# Altium project senocore.PrjPcb
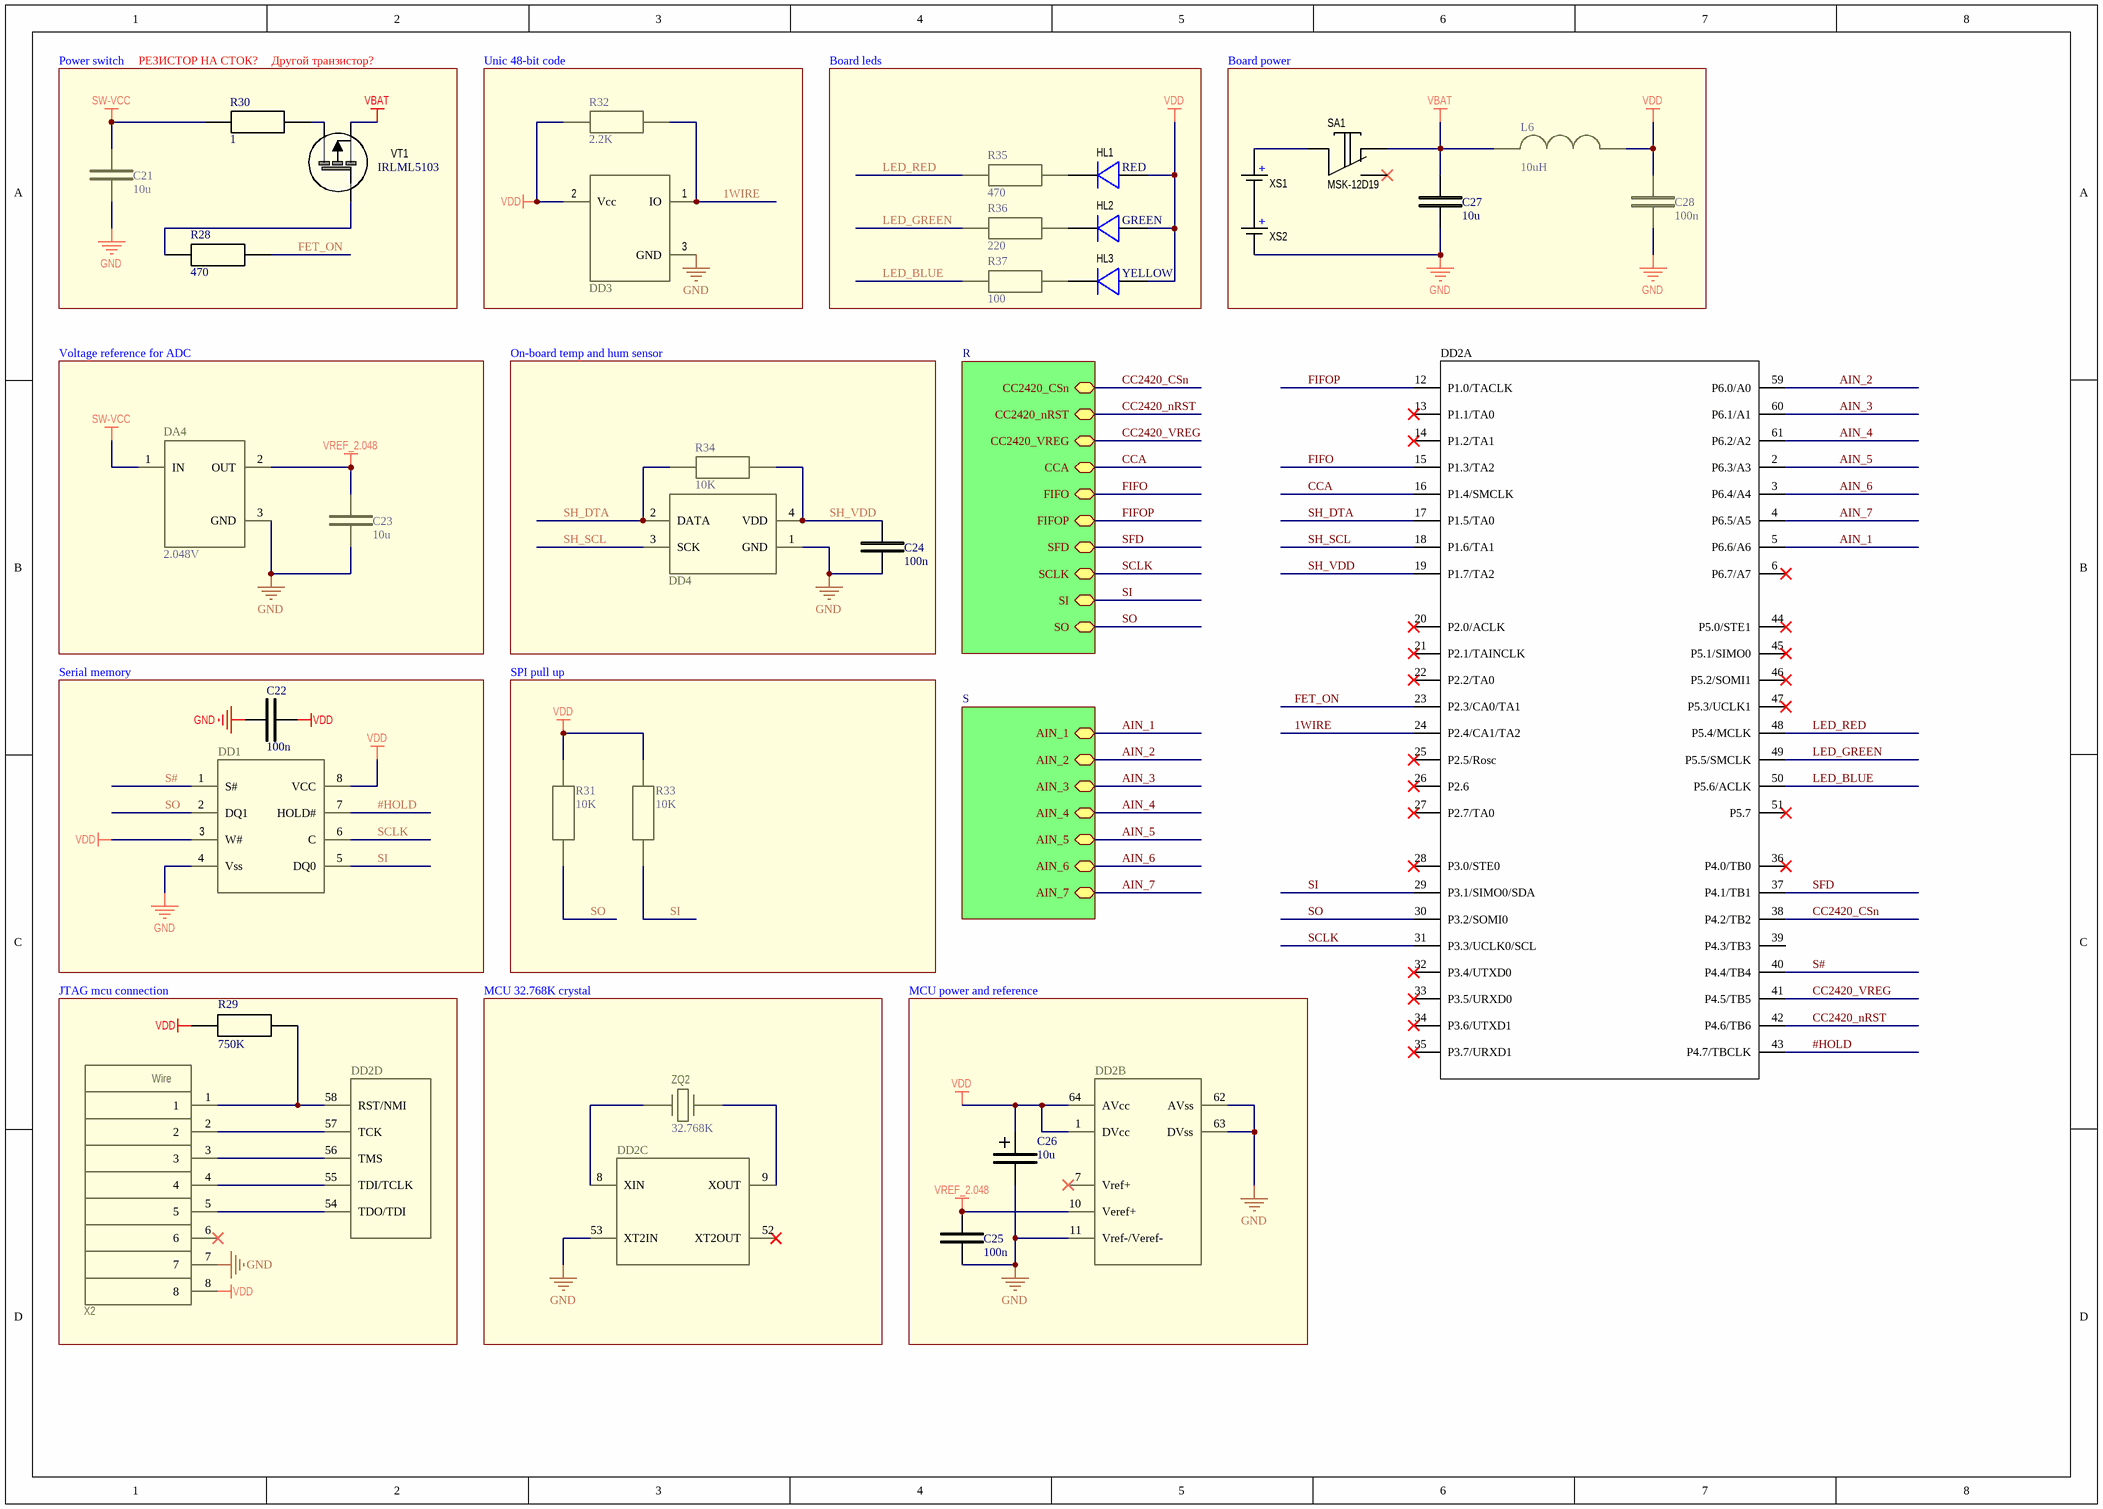
[diagram p0: senocore.SchDoc]
3 sheets, 91 parts. Net scope: hierarchical (ports join the sheet entries above them; power ports are global).
Board file: senocore_pcb_long.PcbDoc
Sheets:
  senocore.SchDoc
    R = radio.SchDoc
    S = NTC connector.SchDoc

## Sheet senocore.SchDoc
size A3

### Parts
C21  10u  [CAP0805]
C22  100n  [CAP0402]
C23  10u  [CAP0805]
C24  100n  [CAP0402]
C25  100n  [CAP0402]
C26  10u  [CapSMDA]
C27  10u  [CAP0805]
C28  100n  [CAP0402]
DA4  2.048V  [SC70-3]
DD1  M25P80V6  [So-8W]  (value not drawn)
DD2  M430F1611  [LQFP-64]  (value not drawn)  (parts A,B,C,D of 4)
DD3  DS2411  [SOT-23-3]  (value not drawn)
DD4  SHT10  [SHT1x]  (value not drawn)
HL1  RED  [LED RED TH L-1394IDT]
HL2  GREEN  [LED GREEN TH L-1394GDT]
HL3  YELLOW  [LED YELLOW TH L-1394YDT]
L6  10uH  [IND0805]
R28  470  [RES0402]
R29  750K  [RES0402]
R30  1  [RES0402]
R31  10K  [RES0402]
R32  2.2K  [RES0402]
R33  10K  [RES0402]
R34  10K  [RES0402]
R35  470  [RES0402]
R36  220  [RES0402]
R37  100  [RES0402]
SA1  MSK-12D19  [MSK-12D19 SPDT]
VT1  IRLML5103  [SOT-23-3]
X2  DS-1026-06 2X4  [PBD2-8 2mm]  (value not drawn)
XS1  Keystone AA Battery Clip  [KEYSTONE AA CLIPS]  (value not drawn)
XS2  Keystone AA Battery Clip  [KEYSTONE AA CLIPS]  (value not drawn)
ZQ2  32.768K  [DT-26]

### Blocks framed on the sheet
Unic 48-bit code: DD3 R32
Board leds: HL1-HL3 R35-R37
Board power: C27 C28 L6 SA1 XS1 XS2
Voltage reference for ADC: C23 DA4
On-board temp and hum sensor: C24 DD4 R34
Serial memory: C22 DD1
SPI pull up: R31 R33
JTAG mcu connection: DD2 R29 X2
MCU 32.768K crystal: DD2 ZQ2
MCU power and reference: C25 C26 DD2

### Sub-sheets
R = radio.SchDoc: CC2420_CSn, CC2420_nRST, CC2420_VREG, CCA, FIFO, FIFOP, SCLK, SFD, SI, SO
S = NTC connector.SchDoc: AIN_1, AIN_2, AIN_3, AIN_4, AIN_5, AIN_6, AIN_7

### Nets
GND: C21.2 C22.1 C23.2 C24.2 C25.2 C26.2 C27.2 C28.2 DA4.3(GND) DD1.4(Vss) DD2.11(Vref-/Veref-) DD2.53(XT2IN) DD2.62(AVss) DD2.63(DVss) DD3.3(GND) DD4.1(GND) X2.7 XS2.2
SW-VCC: C21.1 DA4.1(IN) R30.2
VBAT: C27.1 L6.1 SA1.1 VT1.2
VDD: C22.2 C26.1 C28.1 DD1.3(W#) DD1.8(VCC) DD2.1(DVcc) DD2.64(AVcc) DD3.2(Vcc) HL1.1(Anode) HL2.1(Anode) HL3.1(Anode) L6.2 R29.2 R31.1 R32.2 R33.1 X2.8
VREF_2.048: C23.1 C25.1 DA4.2(OUT) DD2.10(Veref+)
1WIRE: DD2.24(P2.4/CA1/TA2) DD3.1(IO) R32.1
#HOLD: DD1.7(HOLD#) DD2.43(P4.7/TBCLK)
AIN_1: DD2.5(P6.6/A6) ; sheet S/AIN_1
AIN_2: DD2.59(P6.0/A0) ; sheet S/AIN_2
AIN_3: DD2.60(P6.1/A1) ; sheet S/AIN_3
AIN_4: DD2.61(P6.2/A2) ; sheet S/AIN_4
AIN_5: DD2.2(P6.3/A3) ; sheet S/AIN_5
AIN_6: DD2.3(P6.4/A4) ; sheet S/AIN_6
AIN_7: DD2.4(P6.5/A5) ; sheet S/AIN_7
CC2420_CSn: DD2.38(P4.2/TB2) ; sheet R/CC2420_CSn
CC2420_nRST: DD2.42(P4.6/TB6) ; sheet R/CC2420_nRST
CC2420_VREG: DD2.41(P4.5/TB5) ; sheet R/CC2420_VREG
CCA: DD2.16(P1.4/SMCLK) ; sheet R/CCA
FET_ON: DD2.23(P2.3/CA0/TA1) R28.1
FIFO: DD2.15(P1.3/TA2) ; sheet R/FIFO
FIFOP: DD2.12(P1.0/TACLK) ; sheet R/FIFOP
LED_BLUE: DD2.50(P5.6/ACLK) R37.2
LED_GREEN: DD2.49(P5.5/SMCLK) R36.2
LED_RED: DD2.48(P5.4/MCLK) R35.2
S#: DD1.1(S#) DD2.40(P4.4/TB4)
SCLK: DD1.6(C) DD2.31(P3.3/UCLK0/SCL) ; sheet R/SCLK
SFD: DD2.37(P4.1/TB1) ; sheet R/SFD
SH_DTA: DD2.17(P1.5/TA0) DD4.2(DATA) R34.2
SH_SCL: DD2.18(P1.6/TA1) DD4.3(SCK)
SH_VDD: C24.1 DD2.19(P1.7/TA2) DD4.4(VDD) R34.1
SI: DD1.5(DQ0) DD2.29(P3.1/SIMO0/SDA) R33.2 ; sheet R/SI
SO: DD1.2(DQ1) DD2.30(P3.2/SOMI0) R31.2 ; sheet R/SO
NetDD2_8: DD2.8(XIN) ZQ2.1
NetDD2_9: DD2.9(XOUT) ZQ2.2
NetDD2_54: DD2.54(TDO/TDI) X2.5
NetDD2_55: DD2.55(TDI/TCLK) X2.4
NetDD2_56: DD2.56(TMS) X2.3
NetDD2_57: DD2.57(TCK) X2.2
NetDD2_58: DD2.58(RST/NMI) R29.1 X2.1
NetHL1_2: HL1.2(Cathode) R35.1
NetHL2_2: HL2.2(Cathode) R36.1
NetHL3_2: HL3.2(Cathode) R37.1
NetR28_2: R28.2 VT1.1
NetR30_1: R30.1 VT1.3
NetSA1_2: SA1.2 XS1.1(+)
NetXS1_2: XS1.2 XS2.1(+)

Not connected (* = marked no-connect by the designer): DD2 6(P6.7/A7)* 7(Vref+)* 13(P1.1/TA0)* 14(P1.2/TA1)* 20(P2.0/ACLK)* 21(P2.1/TAINCLK)* 22(P2.2/TA0)* 25(P2.5/Rosc)* 26(P2.6)* 27(P2.7/TA0)* 28(P3.0/STE0)* 32(P3.4/UTXD0)* 33(P3.5/URXD0)* 34(P3.6/UTXD1)* 35(P3.7/URXD1)* 36(P4.0/TB0)* 39(P4.3/TB3) 44(P5.0/STE1)* 45(P5.1/SIMO0)* 46(P5.2/SOMI1)* 47(P5.3/UCLK1)* 51(P5.7)* 52(XT2OUT)*; SA1 3*; X2 6*

### Notes on the sheet
- Power switch
- (near R30) РЕЗИСТОР НА СТОК?
- (near R30) Другой транзистор?
- (in symbol PBD2-8 step 2mm) Wire

### Library data of the parts
C21 C23 C27 = 10u SMD 0805: 0805 SMD; PartNumber: CL21A106KPFNNNG; Manufacturer: Samsung; Supplier: Terraelectronica; Unit Price: 1.2; WebLink: https://www.terraelectronica.ru/product/984943
C22 C24 C25 C28 = 100n SMD 0402: 0402 SMD; PartNumber: CC0402ZRY5V7BB104; Manufacturer: Yageo; Supplier: Terraelectronica; Unit Price: 0.22; WebLink: https://www.terraelectronica.ru/product/543093
C26 = 10u SMD TYPE A: SMD TYPE A; PartNumber: T491A106K010AT; Manufacturer: Kemet; Supplier: Terraelectronica; Unit Price: 5; WebLink: https://www.terraelectronica.ru/product/556976
DA4 = REF3320: Reference 2.048V; PartNumber: REF3318AIDCKR, REF3318AIDCKT; Manufacturer: Texas Instruments; Supplier: Terrraelectronica; Unit Price: 67; WebLink: https://www.terraelectronica.ru/catalog/istochniki-opornogo-napryazheniya-i-toka-256?text=ref3320&search=ref3320
DD1 = M25P80V6: Serial memory 2.7-3.6V, 8 Mbit (1 Mbyte); PartNumber: M25P80-VMW; Manufacturer: Micron; Supplier: Chipdip; Unit Price: 130; WebLink: https://www.chipdip.ru/product1/8344124196
DD2 = M430F1611: MCU; PartNumber: MSP430F1611IPM; Manufacturer: Texas Instruments; Supplier: Terraelectronica; Unit Price: 1480; WebLink: https://www.terraelectronica.ru/product/67958
DD3 = DS2411: Unic 48bit serial code. Family code 0x01; PartNumber: DS2411R+T&R; Manufacturer: Maxim; Supplier: Chipdip; Unit Price: 130; WebLink: https://www.chipdip.ru/product/ds2411r-t-r-2
DD4 = SHT10: Temp and hum sensor; Manufacturer: Sensirion; PartNumber: SHT10; Supplier: Terraelectronica; Unit Price: 998; WebLink: https://www.terraelectronica.ru/product/325109
HL1 = LED Flat top RED TH 3.4mm/2mm: 10 mA, V=2.5 V; PartNumber: GNL-3012HD; Manufacturer: G-nor Electronics; Supplier: Chipdip; Unit Price: 8; WebLink: https://www.chipdip.ru/product/gnl-3012hd
HL2 = LED Flat top GREEN TH 3.4mm/2mm: 10 mA, V=2.5 V; PartNumber: GNL-3012GD; Manufacturer: G-nor Electronics; Supplier: Chipdip; Unit Price: 8; WebLink: https://www.chipdip.ru/product/gnl-3012gd
HL3 = LED Flat top YELLOW TH 3.4mm/2mm: 10 mA, V=2.5 V; PartNumber: GNL-3012YD; Manufacturer: G-nor Electronics; Supplier: Chipdip; Unit Price: 8; WebLink: https://www.chipdip.ru/product/gnl-3012yd
L6 = IND 10uH SMD 0805: 0805 SMD; PartNumber: LQM21FN100M80L; Manufacturer: Murata; Supplier: Terraelectronica; Unit Price: 4.4; WebLink: https://www.terraelectronica.ru/product/1496283
R28 R35 = 470R 1% SMD 0402: 1% 0402 SMD 0.063W; PartNumber: RC0402FR-07470RL; Manufacturer: Yageo; Supplier: Terraelectronica; Unit Price: 0.1; WebLink: https://www.terraelectronica.ru/product/870778
R29 = 750K 1% SMD 0402: 1% 0402 SMD 0.063W; PartNumber: RC0402FR-07750KL; Manufacturer: Yageo; Supplier: Terraelectronica; Unit Price: 0.1; WebLink: https://www.terraelectronica.ru/product/870851
R30 = 1R 1% SMD 0402: 1% 0402 SMD 0.063W; PartNumber: RC0402FR-071RL; Manufacturer: Yageo; Supplier: Terraelectronica; Unit Price: 0.1; WebLink: https://www.terraelectronica.ru/product/870639
R31 R33 R34 = 10K 1% SMD 0402: 1% 0402 SMD 0.063W; PartNumber: RC0402FR-0710KL; Manufacturer: Yageo; Supplier: Terraelectronica; Unit Price: 0.1; WebLink: tps://www.terraelectronica.ru/product/358779
R32 = 2.2K 1% SMD 0402: 1% 0402 SMD 0.063W; PartNumber: RC0402FR-072K2L; Manufacturer: Yageo; Supplier: Terraelectronica; Unit Price: 0.11; WebLink: https://www.terraelectronica.ru/product/560314
R36 = 220R 1% SMD 0402: 1% 0402 SMD 0.063W; PartNumber: RC0402FR-07220RL; Manufacturer: Yageo; Supplier: Terraelectronica; Unit Price: 0.1; WebLink: https://www.terraelectronica.ru/product/870650
R37 = 100R 1% SMD 0402: 1% 0402 SMD 0.063W; PartNumber: RC0402FR-07100RL; Manufacturer: Yageo; Supplier: Terraelectronica; Unit Price: 0.11; WebLink: https://www.terraelectronica.ru/product/361823
SA1 = SPD 3 pin MSK-12D19: Slide switch 3 pin; Manufacturer: Shenzhen Intech Electronic; WebLink: http://www.intechswitch.com/products/SideKnobToggleslideswitchseries/641.html; Unit Price: 20; PartNumber: MSK-12D19
VT1 = IRLML5103: p-mosfet   -30V 0.76A Vgs=-1V; PartNumber: IRLML5103TRPBF; Manufacturer: International Rectifier; Supplier: Chipdip; Unit Price: 9; WebLink: https://www.chipdip.ru/product/irlml5103tr
X2 = PBD2-8 step 2mm: Step 2mm 2x4 height 4.3mm; PartNumber: DS1026-06-2*4S8BV; Manufacturer: Ningbo connfly electronic; Supplier: Chipdip; Unit Price: 11; WebLink: https://www.chipdip.ru/product/pbd2-8
XS1 XS2 = Keystone AA Battery Clip: Button Contact; PartNumber: 92; WebLink: https://www.keyelco.com/category.cfm/Cylindrical-Cell-Clips-THM-and-SMT/AA-CR2-Battery-Clips-and-Contacts/id/945; Manufacturer: Keystone
ZQ2 = ZQ 32.768K 12.5pF 20ppm: Load 12.5pF 20ppm; PartNumber: 32768Hz(2x6mm); Manufacturer: China; Supplier: Chipdip; Unit Price: 12; WebLink: https://www.chipdip.ru/product/32768hz-2x6mm

## Sheet radio.SchDoc
size A3
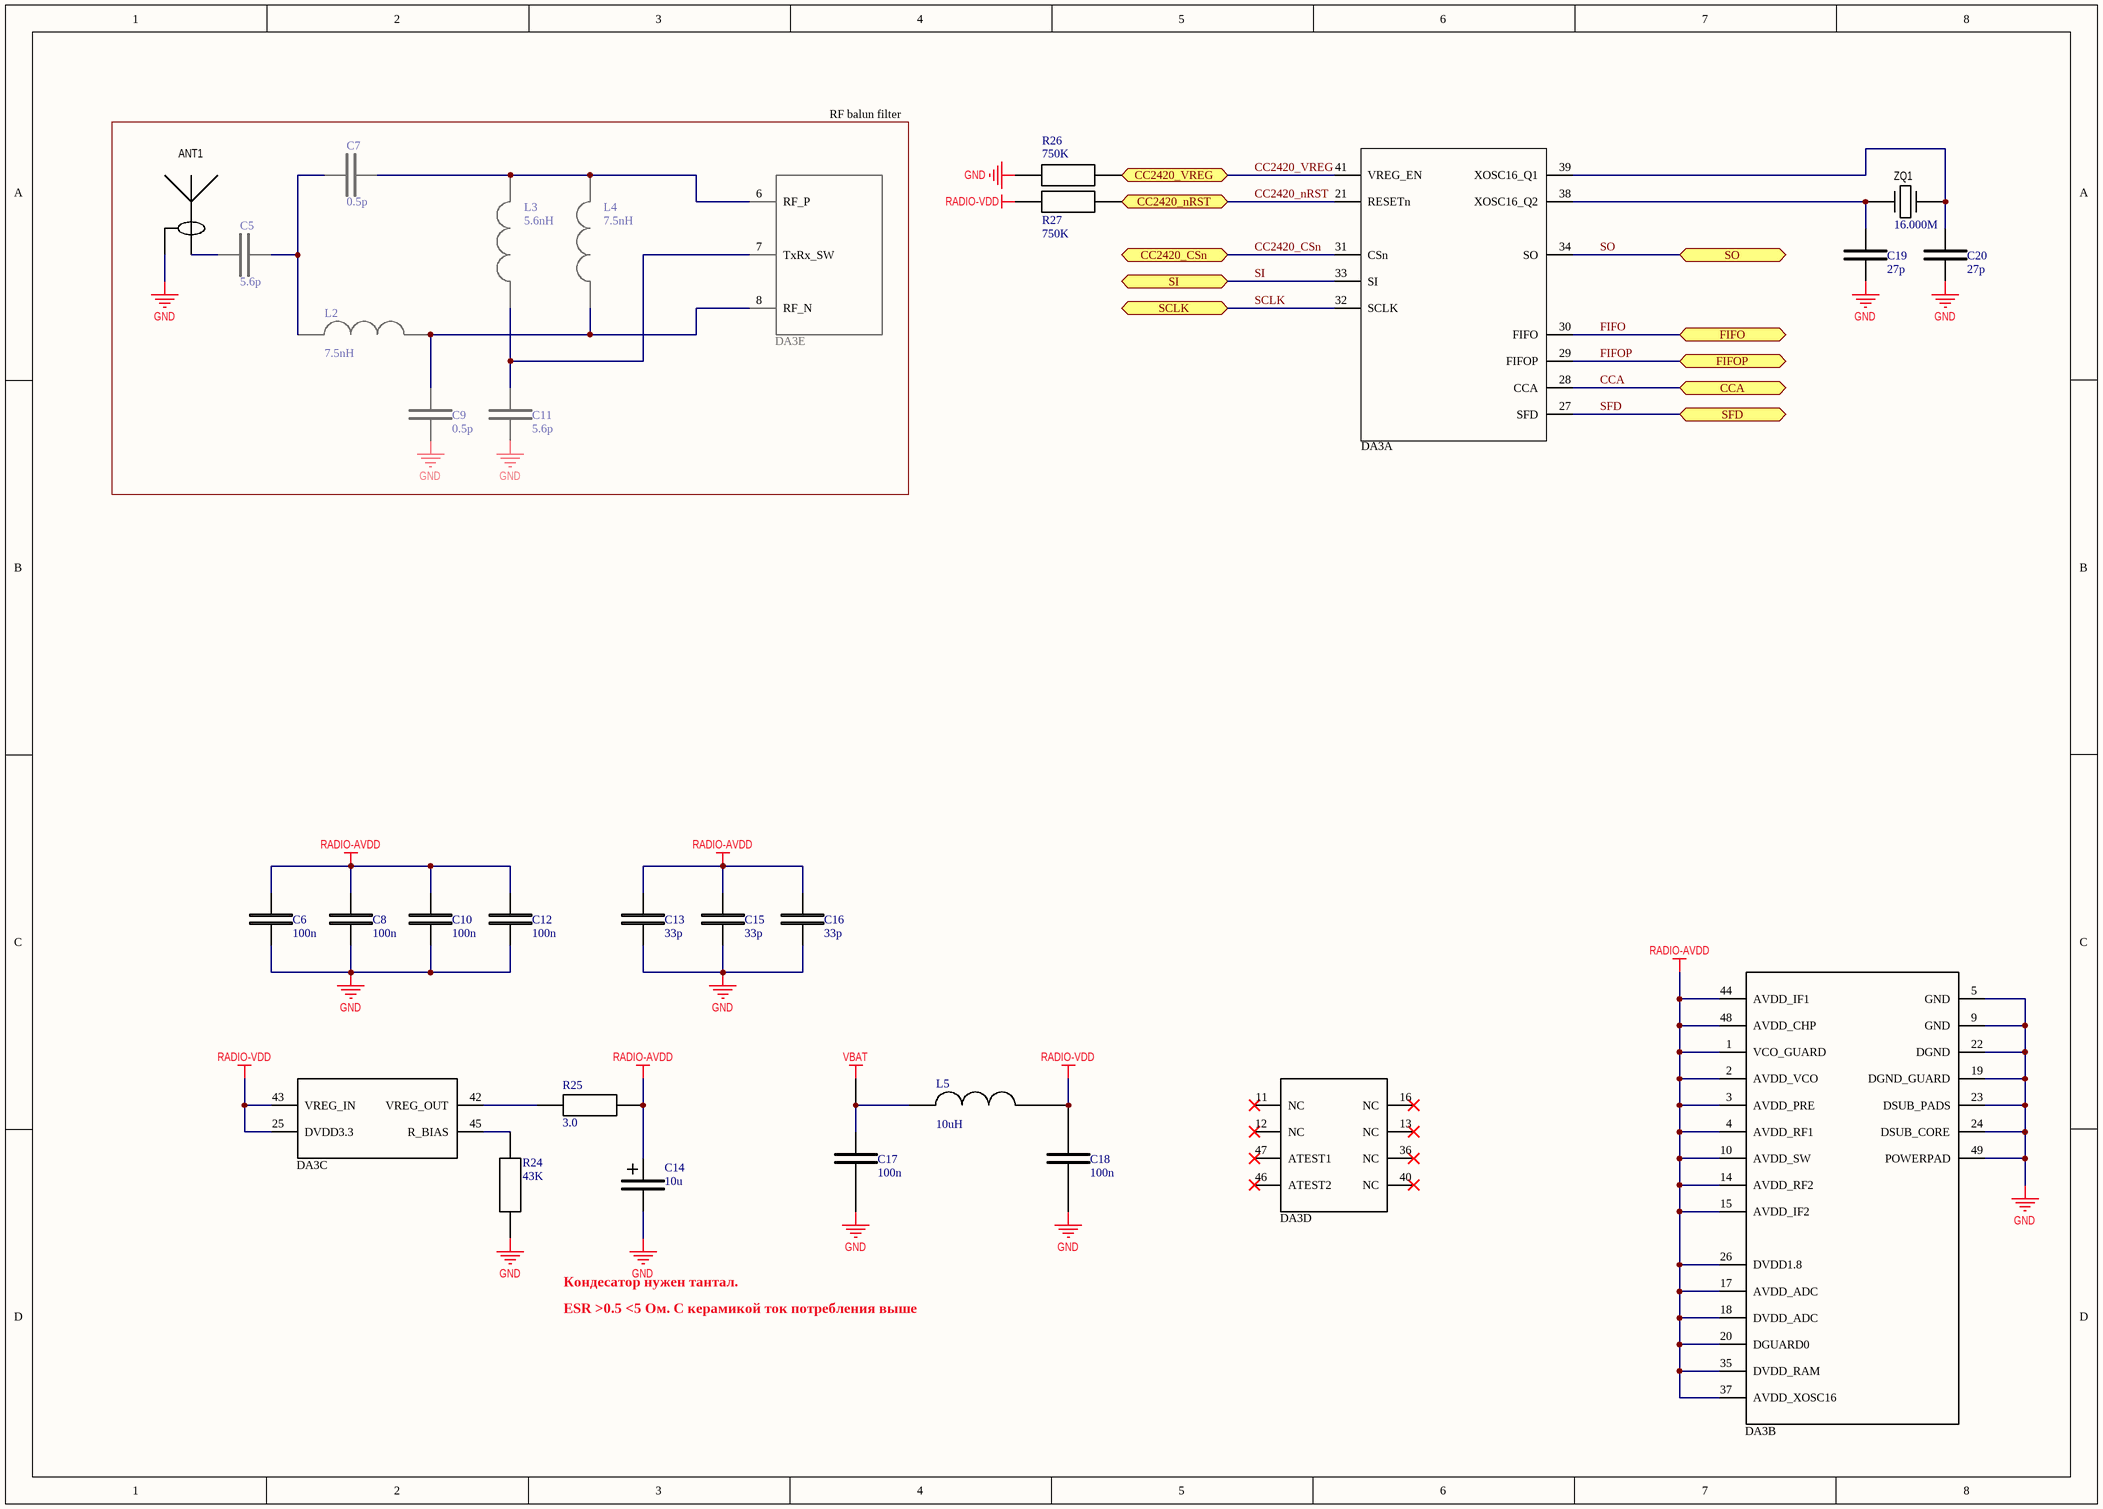
[diagram p1: radio.SchDoc]

### Parts
ANT1  PCB ANTENNA 2.4Ghz  [F-antena]  (value not drawn)
C5  5.6p  [CAP0402]
C6  100n  [CAP0402]
C7  0.5p  [CAP0402]
C8  100n  [CAP0402]
C9  0.5p  [CAP0402]
C10  100n  [CAP0402]
C11  5.6p  [CAP0402]
C12  100n  [CAP0402]
C13  33p  [CAP0402]
C14  10u  [CapSMDA]
C15  33p  [CAP0402]
C16  33p  [CAP0402]
C17  100n  [CAP0402]
C18  100n  [CAP0402]
C19  27p  [CAP0402]
C20  27p  [CAP0402]
DA3  CC2420  [QLP-48]  (value not drawn)  (parts A,B,C,D,E of 5)
L2  7.5nH  [IND0402]
L3  5.6nH  [IND0402]
L4  7.5nH  [IND0402]
L5  10uH  [IND0805]
R24  43K  [RES0402]
R25  3.0  [RES0402]
R26  750K  [RES0402]
R27  750K  [RES0402]
ZQ1  16.000M  [HC49SMD]

### Blocks framed on the sheet
RF balun filter: ANT1 C5 C7 C9 C11 DA3 L2-L4

### Ports
CC2420_CSn, CC2420_nRST, CC2420_VREG, CCA, FIFO, FIFOP, SCLK, SFD, SI, SO

### Nets
GND: ANT1.2 C6.2 C8.2 C9.2 C10.2 C11.2 C12.2 C13.2 C14.2 C15.2 C16.2 C17.2 C18.2 C19.2 C20.2 DA3.5(GND) DA3.9(GND) DA3.19(DGND_GUARD) DA3.22(DGND) DA3.23(DSUB_PADS) DA3.24(DSUB_CORE) DA3.49(POWERPAD) R24.1 R26.2
RADIO-AVDD: C6.1 C8.1 C10.1 C12.1 C13.1 C14.1 C15.1 C16.1 DA3.1(VCO_GUARD) DA3.2(AVDD_VCO) DA3.3(AVDD_PRE) DA3.4(AVDD_RF1) DA3.10(AVDD_SW) DA3.14(AVDD_RF2) DA3.15(AVDD_IF2) DA3.17(AVDD_ADC) DA3.18(DVDD_ADC) DA3.20(DGUARD0) DA3.26(DVDD1.8) DA3.35(DVDD_RAM) DA3.37(AVDD_XOSC16) DA3.44(AVDD_IF1) DA3.48(AVDD_CHP) R25.1
RADIO-VDD: C18.1 DA3.25(DVDD3.3) DA3.43(VREG_IN) L5.2 R27.2
VBAT: C17.1 L5.1
CC2420_CSn: DA3.31(CSn) ; port CC2420_CSn
CC2420_nRST: DA3.21(RESETn) R27.1 ; port CC2420_nRST
CC2420_VREG: DA3.41(VREG_EN) R26.1 ; port CC2420_VREG
CCA: DA3.28(CCA) ; port CCA
FIFO: DA3.30(FIFO) ; port FIFO
FIFOP: DA3.29(FIFOP) ; port FIFOP
SCLK: DA3.32(SCLK) ; port SCLK
SFD: DA3.27(SFD) ; port SFD
SI: DA3.33(SI) ; port SI
SO: DA3.34(SO) ; port SO
NetANT1_1: ANT1.1 C5.1
NetC5_2: C5.2 C7.1 L2.1
NetC7_2: C7.2 DA3.6(RF_P) L3.2 L4.2
NetC9_1: C9.1 DA3.8(RF_N) L2.2 L4.1
NetC11_1: C11.1 DA3.7(TxRx_SW) L3.1
NetC19_1: C19.1 DA3.38(XOSC16_Q2) ZQ1.2
NetC20_1: C20.1 DA3.39(XOSC16_Q1) ZQ1.1
NetDA3_42: DA3.42(VREG_OUT) R25.2
NetDA3_45: DA3.45(R_BIAS) R24.2

Not connected (* = marked no-connect by the designer): DA3 11(NC)* 12(NC)* 13(NC)* 16(NC)* 36(NC)* 40(NC)* 46(ATEST2)* 47(ATEST1)*

### Notes on the sheet
- Кондесатор нужен тантал.
- ESR >0.5 <5 Ом. С керамикой ток потребления выше

### Library data of the parts
ANT1 = PCB ANTENNA 2.4Ghz: PartNumber: PCB PRINT
C5 C11 = 5.6p SMD 0402: +/- 0.25pF NP0 SMD 0402; PartNumber: CC0402CRNPO9BN5R6; Manufacturer: Yageo; Supplier: Terraelectronica; Unit Price: 0.27; WebLink: https://www.terraelectronica.ru/product/980955
C6 C8 C10 C12 C17 C18 = 100n SMD 0402: as C22 on sheet senocore; Supplier: Terraelectronica; Unit Price: 0.22; WebLink: https://www.terraelectronica.ru/product/543093
C7 C9 = 0.5p SMD 0402: +/- 0.25pF NP0 SMD 0402; PartNumber: GRM1555C1HR50BA01D; Manufacturer: Murata; Supplier: Terraelectronica; Unit Price: 0.69; WebLink: https://www.terraelectronica.ru/product/817877
C13 C15 C16 = 33p SMD 0402: 0402 SMD; PartNumber: CC0402JRNPO9BN330; Manufacturer: Yageo; Supplier: Terraelectronica; Unit Price: 0.24; WebLink: https://www.terraelectronica.ru/product/367363
C14 = 10u SMD TYPE A: as C26 on sheet senocore; Supplier: Terraelectronica; Unit Price: 5; WebLink: https://www.terraelectronica.ru/product/556976
C19 C20 = 27p SMD 0402: 0402 SMD; PartNumber: CL05C270JB5NNNC; Manufacturer: Samsung; Supplier: Terraelectronica; Unit Price: 0.24; WebLink: https://www.terraelectronica.ru/product/863257
DA3 = CC2420: 2.4 GHz transiver; PartNumber: CC2420RGZR; Manufacturer: Texas Instruments; Supplier: Terraelectronica; Unit Price: 439; WebLink: https://www.terraelectronica.ru/catalog/integralnye-mikroshemy-dlya-radiosvyazi-274?text=cc2420&search=cc2420
L2 L4 = IND 7.5nH SMD 0402: SMD 0402 5%; PartNumber: LQG15HS7N5J02D; Manufacturer: Murata; Supplier: Terraelectronica; Unit Price: 1.1; WebLink: https://www.terraelectronica.ru/product/574342
L3 = IND 5.6nH SMD 0402: SMD 0402 5%; PartNumber: LQG15HS5N6S02D; Manufacturer: Murata; Supplier: Terraelectronica; Unit Price: 1.1; WebLink: https://www.terraelectronica.ru/product/867408
L5 = IND 10uH SMD 0805: as L6 on sheet senocore; Supplier: Terraelectronica; Unit Price: 4.4; WebLink: https://www.terraelectronica.ru/product/1496283
R24 = 43K 1% SMD 0402: 1% 0402 SMD 0.063W; PartNumber: RC0402FR-0743KL; Manufacturer: Yageo; Supplier: Terraelectronica; Unit Price: 0.11; WebLink: https://www.terraelectronica.ru/product/870768
R25 = 3.0R 1% SMD 0402: 1% 0402 SMD 0.063W
R26 R27 = 750K 1% SMD 0402: as R29 on sheet senocore; Supplier: Terraelectronica; Unit Price: 0.1; WebLink: https://www.terraelectronica.ru/product/870851
ZQ1 = ZQ 16.000M 12pF 20ppm: Load 12pF 20ppm; PartNumber: 16.000MHzHC-49SM; Manufacturer: China; Supplier: Chipdip; Unit Price: 15; WebLink: https://www.chipdip.ru/product/16mhz-hc-49sm?from=suggest_product

## Sheet NTC connector.SchDoc
size A3
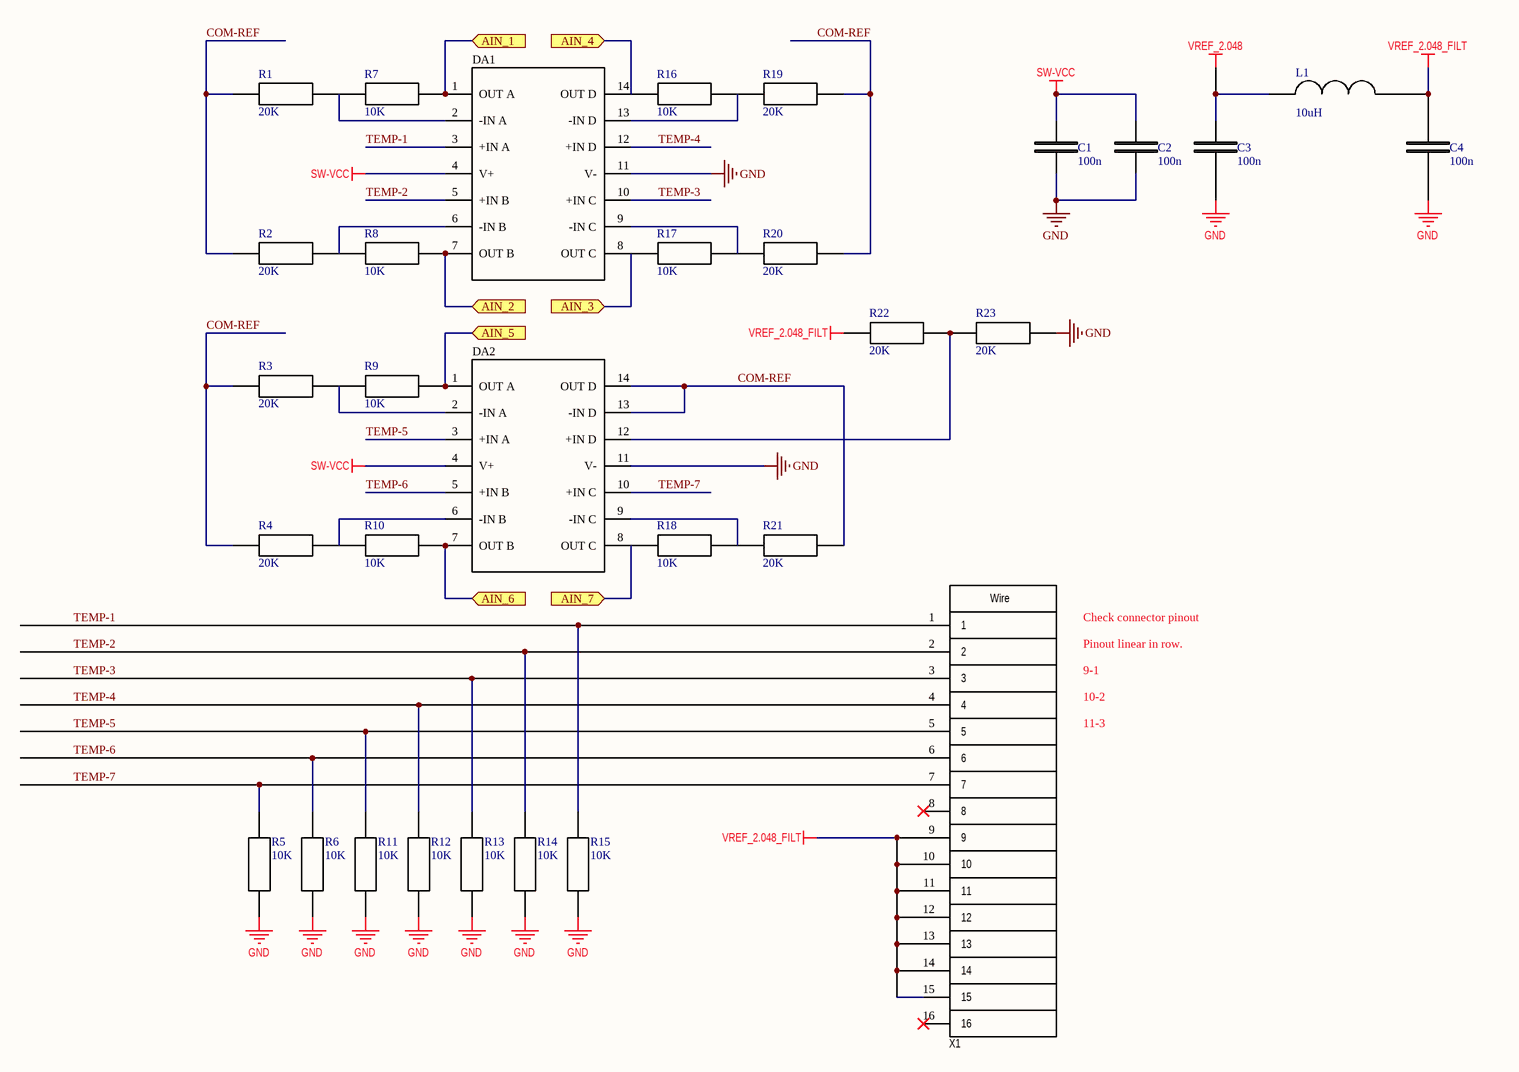
[diagram p2: NTC connector.SchDoc]

### Parts
C1  100n  [CAP0402]
C2  100n  [CAP0402]
C3  100n  [CAP0402]
C4  100n  [CAP0402]
DA1  OPA4376  [TSSOP-14]  (value not drawn)
DA2  OPA4376  [TSSOP-14]  (value not drawn)
L1  10uH  [IND0805]
R1  20K  [RES0402]
R2  20K  [RES0402]
R3  20K  [RES0402]
R4  20K  [RES0402]
R5  10K  [RES0402]
R6  10K  [RES0402]
R7  10K  [RES0402]
R8  10K  [RES0402]
R9  10K  [RES0402]
R10  10K  [RES0402]
R11  10K  [RES0402]
R12  10K  [RES0402]
R13  10K  [RES0402]
R14  10K  [RES0402]
R15  10K  [RES0402]
R16  10K  [RES0402]
R17  10K  [RES0402]
R18  10K  [RES0402]
R19  20K  [RES0402]
R20  20K  [RES0402]
R21  20K  [RES0402]
R22  20K  [RES0402]
R23  20K  [RES0402]
X1  Microfit3.0 16 pins R thru hole  [microfit30_16]  (value not drawn)

### Ports
AIN_1 (in), AIN_2 (in), AIN_3 (in), AIN_4 (in), AIN_5 (in), AIN_6 (in), AIN_7 (in)

### Nets
GND: C1.2 C2.2 C3.2 C4.2 DA1.11(V-) DA2.11(V-) R5.2 R6.2 R11.2 R12.2 R13.2 R14.2 R15.2 R23.2
SW-VCC: C1.1 C2.1 DA1.4(V+) DA2.4(V+)
VREF_2.048: C3.1 L1.1
VREF_2.048_FILT: C4.1 L1.2 R22.1 X1.9 X1.10 X1.11 X1.12 X1.13 X1.14 X1.15
AIN_1: DA1.1(OUT_A) R7.1 ; port AIN_1
AIN_2: DA1.7(OUT_B) R8.1 ; port AIN_2
AIN_3: DA1.8(OUT_C) R17.2 ; port AIN_3
AIN_4: DA1.14(OUT_D) R16.2 ; port AIN_4
AIN_5: DA2.1(OUT_A) R9.1 ; port AIN_5
AIN_6: DA2.7(OUT_B) R10.1 ; port AIN_6
AIN_7: DA2.8(OUT_C) R18.2 ; port AIN_7
COM-REF: DA2.13(-IN_D) DA2.14(OUT_D) R1.2 R2.2 R3.2 R4.2 R19.1 R20.1 R21.1
TEMP-1: DA1.3(+IN_A) R15.1 X1.1
TEMP-2: DA1.5(+IN_B) R14.1 X1.2
TEMP-3: DA1.10(+IN_C) R13.1 X1.3
TEMP-4: DA1.12(+IN_D) R12.1 X1.4
TEMP-5: DA2.3(+IN_A) R11.1 X1.5
TEMP-6: DA2.5(+IN_B) R6.1 X1.6
TEMP-7: DA2.10(+IN_C) R5.1 X1.7
NetDA1_2: DA1.2(-IN_A) R1.1 R7.2
NetDA1_6: DA1.6(-IN_B) R2.1 R8.2
NetDA1_9: DA1.9(-IN_C) R17.1 R20.2
NetDA1_13: DA1.13(-IN_D) R16.1 R19.2
NetDA2_2: DA2.2(-IN_A) R3.1 R9.2
NetDA2_6: DA2.6(-IN_B) R4.1 R10.2
NetDA2_9: DA2.9(-IN_C) R18.1 R21.2
NetDA2_12: DA2.12(+IN_D) R22.2 R23.1

Not connected (* = marked no-connect by the designer): X1 8* 16*

### Notes on the sheet
- Check connector pinout
- Pinout linear in row.
- 9-1
- 10-2
- 11-3
- (in symbol Microfit3.0 16 pins R thru hole) Wire

### Library data of the parts
C1-C4 = 100n SMD 0402: as C22 on sheet senocore; Supplier: Terraelectronica; Unit Price: 0.22; WebLink: https://www.terraelectronica.ru/product/543093
DA1 DA2 = OPA4376: Opamp  2.2-5.5 V, Offset 5μV; PartNumber: OPA4376AIPW; Manufacturer: Texas Instruments; WebLink: https://www.terraelectronica.ru/product/349931
L1 = IND 10uH SMD 0805: as L6 on sheet senocore; Supplier: Terraelectronica; Unit Price: 4.4; WebLink: https://www.terraelectronica.ru/product/1496283
R1-R4 R19-R23 = 20K 1% SMD 0402: 1% 0402 SMD 0.063W; PartNumber: RC0402FR-0720KL; Manufacturer: Yageo; Supplier: Terraelectronicac; Unit Price: 0.11; WebLink: https://www.terraelectronica.ru/product/506449
R5-R18 = 10K 1% SMD 0402: as R31 on sheet senocore; Supplier: Terraelectronica; Unit Price: 0.1; WebLink: https://www.terraelectronica.ru/product/358779
X1 = Microfit3.0 16 pins R thru hole: Step 3mm, dual row 16 pins, thru hole; PartNumber: 43045-1601 molex; Manufacturer: Molex; Supplier: Chipdip; Unit Price: 450; WebLink: https://www.chipdip.ru/product/43045-1601

## Nets that join several sheets
GND: senocore (18 pins), radio (24 pins), NTC connector (14 pins)
SW-VCC: senocore (C21.1 DA4.1 R30.2), NTC connector (C1.1 C2.1 DA1.4 DA2.4)
VBAT: senocore (C27.1 L6.1 SA1.1 VT1.2), radio (C17.1 L5.1)
VREF_2.048: senocore (C23.1 C25.1 DA4.2 DD2.10), NTC connector (C3.1 L1.1)
AIN_1: senocore (DD2.5), NTC connector (DA1.1 R7.1)
AIN_2: senocore (DD2.59), NTC connector (DA1.7 R8.1)
AIN_3: senocore (DD2.60), NTC connector (DA1.8 R17.2)
AIN_4: senocore (DD2.61), NTC connector (DA1.14 R16.2)
AIN_5: senocore (DD2.2), NTC connector (DA2.1 R9.1)
AIN_6: senocore (DD2.3), NTC connector (DA2.7 R10.1)
AIN_7: senocore (DD2.4), NTC connector (DA2.8 R18.2)
CC2420_CSn: senocore (DD2.38), radio (DA3.31)
CC2420_nRST: senocore (DD2.42), radio (DA3.21 R27.1)
CC2420_VREG: senocore (DD2.41), radio (DA3.41 R26.1)
CCA: senocore (DD2.16), radio (DA3.28)
FIFO: senocore (DD2.15), radio (DA3.30)
FIFOP: senocore (DD2.12), radio (DA3.29)
SCLK: senocore (DD1.6 DD2.31), radio (DA3.32)
SFD: senocore (DD2.37), radio (DA3.27)
SI: senocore (DD1.5 DD2.29 R33.2), radio (DA3.33)
SO: senocore (DD1.2 DD2.30 R31.2), radio (DA3.34)